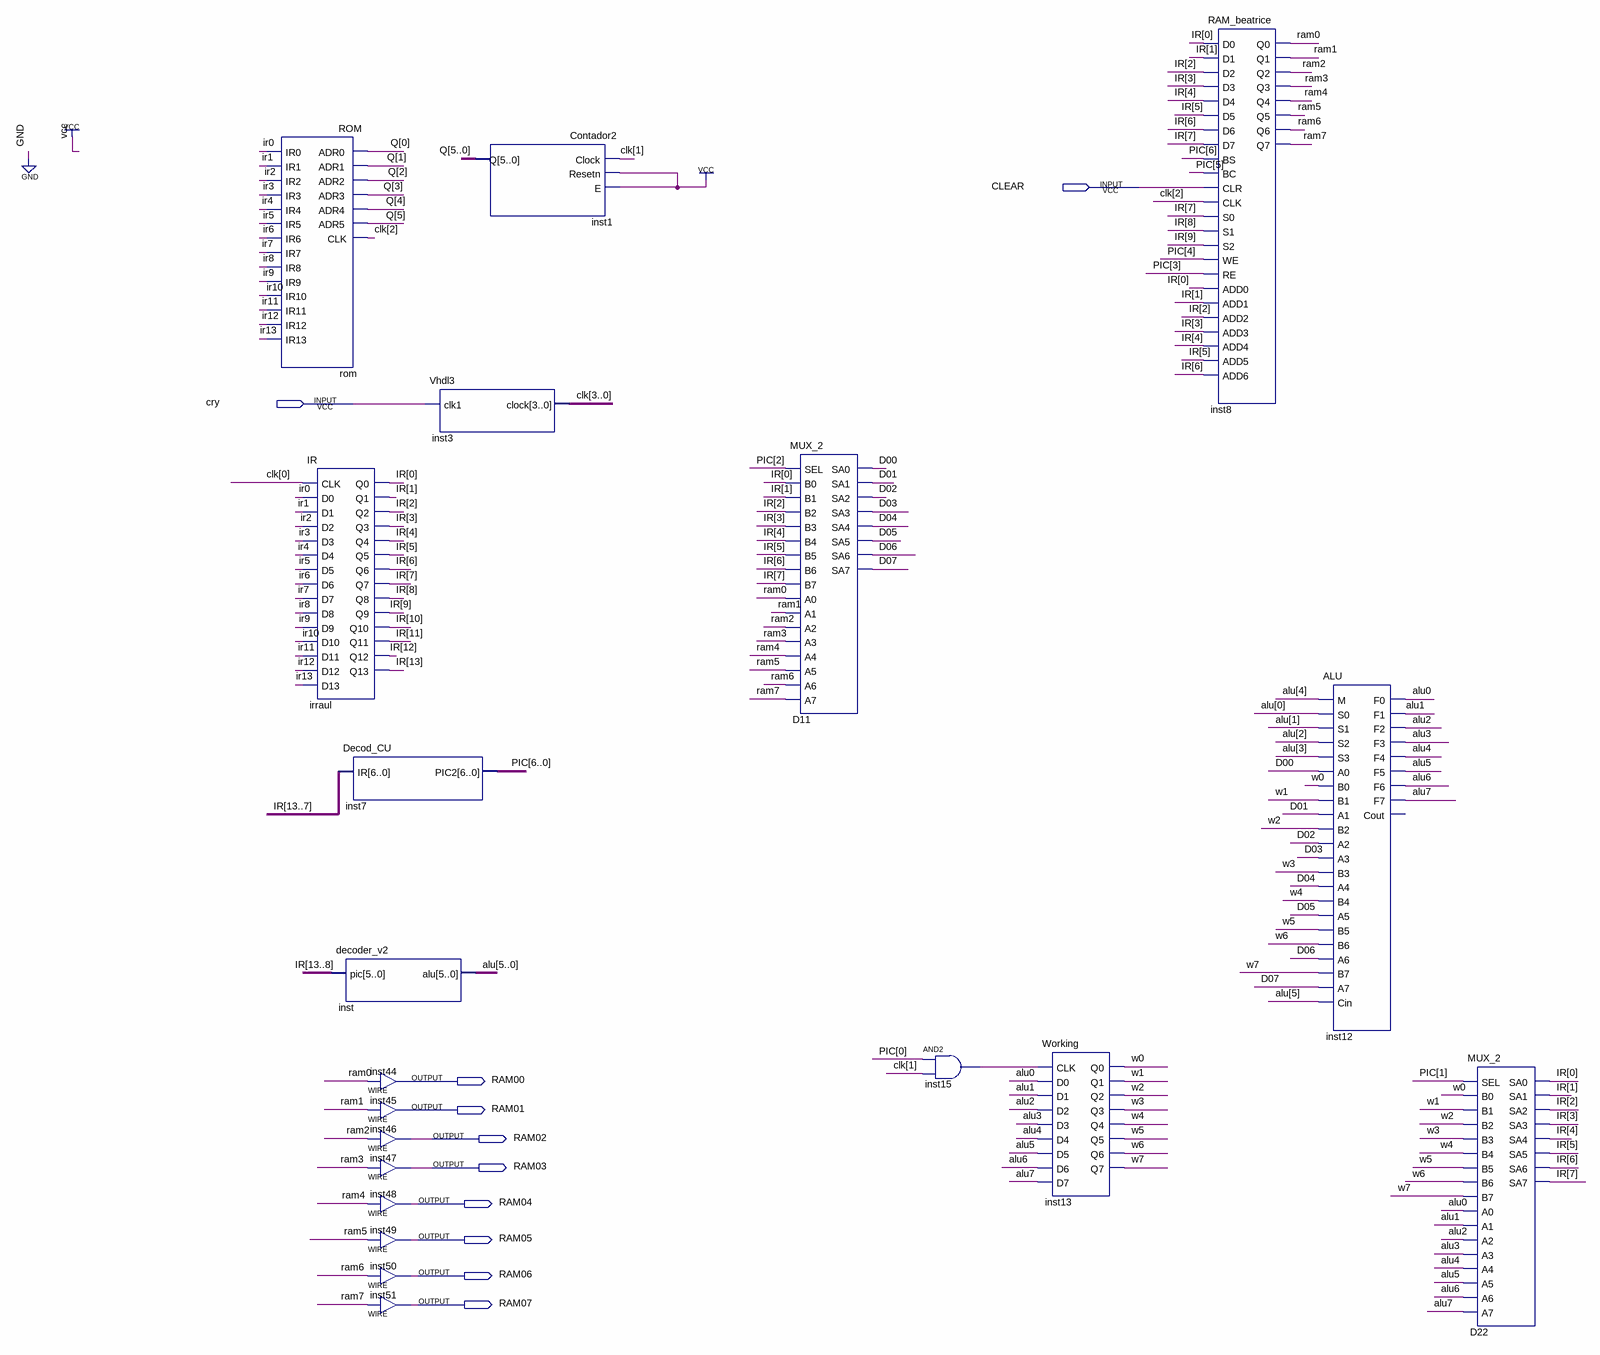
[diagram p0: schematic sheet]
// Quartus schematic CPU_V1.bdf as structural Verilog: 20 symbols, 10 pins
module CPU_V1 (
  input  CLEAR,
  input  cry,
  output RAM00,
  output RAM01,
  output RAM02,
  output RAM03,
  output RAM04,
  output RAM05,
  output RAM06,
  output RAM07
);

  wire alu6, alu7, D00, D01, D02, D03, D04, D05, D06, D07, inst15_out, ram0, ram1, ram2, ram3, ram4, ram5,
       ram6, ram7, w0, w1, w2, w3, w4, w5, w6, w7;
  wire [3:0] clk;
  wire [5:0] alu, Q;
  wire [6:0] PIC;
  wire [13:0] IR;

  ROM rom (
    .ADR0(Q[0]), .ADR1(Q[1]), .ADR2(Q[2]), .ADR3(Q[3]), .ADR4(Q[4]), .ADR5(Q[5]), .CLK(clk[2]), .IR0(IR[0]),
    .IR1(IR[1]), .IR2(IR[2]), .IR3(IR[3]), .IR4(IR[4]), .IR5(IR[5]), .IR6(IR[6]), .IR7(IR[7]), .IR8(IR[8]),
    .IR9(IR[9]), .IR10(IR[10]), .IR11(IR[11]), .IR12(IR[12]), .IR13(IR[13]));
  IR irraul (
    .CLK(clk[0]), .D0(IR[0]), .D1(IR[1]), .D2(IR[2]), .D3(IR[3]), .D4(IR[4]), .D5(IR[5]), .D6(IR[6]),
    .D7(IR[7]), .D8(IR[8]), .D9(IR[9]), .D10(IR[10]), .D11(IR[11]), .D12(IR[12]), .D13(IR[13]), .Q0(IR[0]),
    .Q1(IR[1]), .Q2(IR[2]), .Q3(IR[3]), .Q4(IR[4]), .Q5(IR[5]), .Q6(IR[6]), .Q7(IR[7]), .Q8(IR[8]),
    .Q9(IR[9]), .Q10(IR[10]), .Q11(IR[11]), .Q12(IR[12]), .Q13(IR[13]));
  Decod_CU inst7 (.IR(IR[13:7]), .PIC2(PIC));
  decoder_v2 inst (.pic(IR[13:8]), .alu(alu));
  assign RAM00 = ram0;  // WIRE inst44
  assign RAM01 = ram1;  // WIRE inst45
  assign RAM02 = ram2;  // WIRE inst46
  assign RAM03 = ram3;  // WIRE inst47
  assign RAM04 = ram4;  // WIRE inst48
  assign RAM05 = ram5;  // WIRE inst49
  assign RAM06 = ram6;  // WIRE inst50
  assign RAM07 = ram7;  // WIRE inst51
  Vhdl3 inst3 (.clk1(cry), .clock(clk));
  Contador2 inst1 (.Clock(clk[1]), .Resetn(1'b1), .E(1'b1), .Q(Q));
  MUX_2 D11 (
    .SEL(PIC[2]), .B0(IR[0]), .B1(IR[1]), .B2(IR[2]), .B3(IR[3]), .B4(IR[4]), .B5(IR[5]), .B6(IR[6]),
    .B7(IR[7]), .A0(ram0), .A1(ram1), .A2(ram2), .A3(ram3), .A4(ram4), .A5(ram5), .A6(ram6), .A7(ram7),
    .SA0(D00), .SA1(D01), .SA2(D02), .SA3(D03), .SA4(D04), .SA5(D05), .SA6(D06), .SA7(D07));
  and inst15 (inst15_out, PIC[0], clk[1]);
  Working inst13 (
    .CLK(inst15_out), .D0(alu[0]), .D1(alu[1]), .D2(alu[2]), .D3(alu[3]), .D4(alu[4]), .D5(alu[5]),
    .D6(alu6), .D7(alu7), .Q0(w0), .Q1(w1), .Q2(w2), .Q3(w3), .Q4(w4), .Q5(w5), .Q6(w6), .Q7(w7));
  RAM_beatrice inst8 (
    .D0(IR[0]), .D1(IR[1]), .D2(IR[2]), .D3(IR[3]), .D4(IR[4]), .D5(IR[5]), .D6(IR[6]), .D7(IR[7]),
    .BS(PIC[6]), .BC(PIC[5]), .CLR(CLEAR), .CLK(clk[2]), .S0(IR[7]), .S1(IR[8]), .S2(IR[9]), .WE(PIC[4]),
    .RE(PIC[3]), .ADD0(IR[0]), .ADD1(IR[1]), .ADD2(IR[2]), .ADD3(IR[3]), .ADD4(IR[4]), .ADD5(IR[5]),
    .ADD6(IR[6]), .Q0(ram0), .Q1(ram1), .Q2(ram2), .Q3(ram3), .Q4(ram4), .Q5(ram5), .Q6(ram6), .Q7(ram7));
  ALU inst12 (
    .M(alu[4]), .S0(alu[0]), .S1(alu[1]), .S2(alu[2]), .S3(alu[3]), .A0(D00), .B0(w0), .B1(w1), .A1(D01),
    .B2(w2), .A2(D02), .A3(D03), .B3(w3), .A4(D04), .B4(w4), .A5(D05), .B5(w5), .B6(w6), .A6(D06), .B7(w7),
    .A7(D07), .Cin(alu[5]), .F0(alu[0]), .F1(alu[1]), .F2(alu[2]), .F3(alu[3]), .F4(alu[4]), .F5(alu[5]),
    .F6(alu6), .F7(alu7));  // open: Cout
  MUX_2 D22 (
    .SEL(PIC[1]), .B0(w0), .B1(w1), .B2(w2), .B3(w3), .B4(w4), .B5(w5), .B6(w6), .B7(w7), .A0(alu[0]),
    .A1(alu[1]), .A2(alu[2]), .A3(alu[3]), .A4(alu[4]), .A5(alu[5]), .A6(alu6), .A7(alu7), .SA0(IR[0]),
    .SA1(IR[1]), .SA2(IR[2]), .SA3(IR[3]), .SA4(IR[4]), .SA5(IR[5]), .SA6(IR[6]), .SA7(IR[7]));
endmodule
